# EAGLE design untitled (EAGLE 9.0.0)
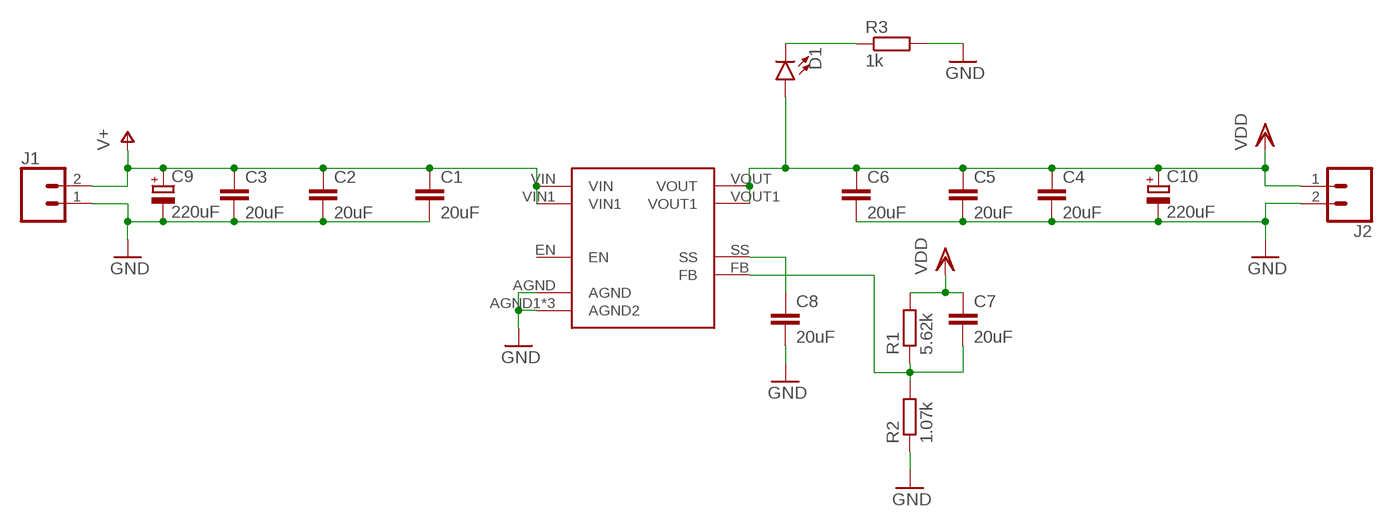
[diagram p0: schematic, sheet 1]

## Parts
C1  20uF  C-EUC0805K  [C0805K]
C2  20uF  C-EUC0805K  [C0805K]
C3  20uF  C-EUC0805K  [C0805K]
C4  20uF  C-EUC0805K  [C0805K]
C5  20uF  C-EUC0805K  [C0805K]
C6  20uF  C-EUC0805K  [C0805K]
C7  20uF  C-EUC0805K  [C0805K]
C8  20uF  C-EUC0805K  [C0805K]
C9  220uF  CPOL-EU153CLV-0810  [153CLV-0810]
C10  220uF  CPOL-EU153CLV-0810  [153CLV-0810]
D1  LED5MM  [LED_5MM]
J1  CONN_025MM  [SCREWTERMINAL-5MM-2]
J2  CONN_025MM  [SCREWTERMINAL-5MM-2]
R1  5.62k  R-EU_R0805  [R0805]
R2  1.07k  R-EU_R0805  [R0805]
R3  1k  R-EU_R0805  [R0805]
U$1  LMZ13610  [LMZ13610]

## Nets
GND: C1.2 C2.2 C3.2 C4.2 C5.2 C6.2 C8.2 C9.- C10.- J1.1 J2.2 R2.1 R3.2 U$1.AGND U$1.AGND1(AGND2) U$1.AGND2 U$1.AGND3(AGND2)
N$1: C8.1 U$1.SS
N$2: C7.2 R1.1 R2.2 U$1.FB
N$3: D1.K(C) R3.1
V+: C1.1 C2.1 C3.1 C9.+ J1.2 U$1.VIN U$1.VIN1
VDD: C4.1 C5.1 C6.1 C7.1 C10.+ D1.A J2.1 R1.2 U$1.VOUT U$1.VOUT1
Unconnected: U$1.EN

## Library data of the parts
C1-C8 = resistor:C-EU: CAPACITOR, European symbol
C9 C10 = resistor:CPOL-EU: POLARIZED CAPACITOR, European symbol
D1 = SparkFun-LED:LED: LED (Generic) Standard schematic elements and footprints for 5mm, 3mm, 1206, and 0603 sized LEDs. Generic LEDs with no color specified.
J1 J2 = SparkFun-Connectors:CONN_02: Multi connection point. Often used as Generic Header-pin footprint for 0.1 inch spaced/style header connections On any of the 0.1 inch spaced packages, you can populate with these: Break Away Headers - Straight <https://www.sparkfun.com/products/116> (PRT-00116) Break Away Male Headers - Right Angle <https://www.sparkfun.com/products/553> (PRT-00553) Female Headers <https://www.sparkfun.com/products/115> (PRT-00115) Break Away Headers - Machine Pin <https://www.sparkfun.com/products/117> (PRT-00117) Break Away Female Headers - Swiss Machine Pin <https://www.sparkfun.com/products/743> (PRT-00743) For SCREWTERMINALS and SPRING TERMINALS visit here: Screw Terimnals on SparkFun.com <https://www.sparkfun.com/search/results?term=Screw+Terminals> (5mm/3.5mm/2.54mm spacing) This device is also useful as a general connection point to wire up your design to another part of your project. Our various solder wires solder well into these plated through hole pads. Hook-Up Wire - Assortment (Stranded, 22 AWG) <https://www.sparkfun.com/products/11375> (PRT-11375) Hook-Up Wire - Assortment (Solid Core, 22 AWG) <https://www.sparkfun.com/products/11367> (PRT-11367) View the entire wire category on our website here <https://www.sparkfun.com/categories/141> Special notes: Molex polarized connector foot print use with: PRT-08233 with associated crimp pins and housings. 2.54_SCREWTERM for use with PRT-10571. 3.5mm Screw Terminal footprints for PRT-08084 5mm Screw Terminal footprints for use with PRT-08432; SF_SKU: PRT-08432
R1-R3 = resistor:R-EU_: RESISTOR, European symbol
U$1 = My lib:LMZ13610

## Board
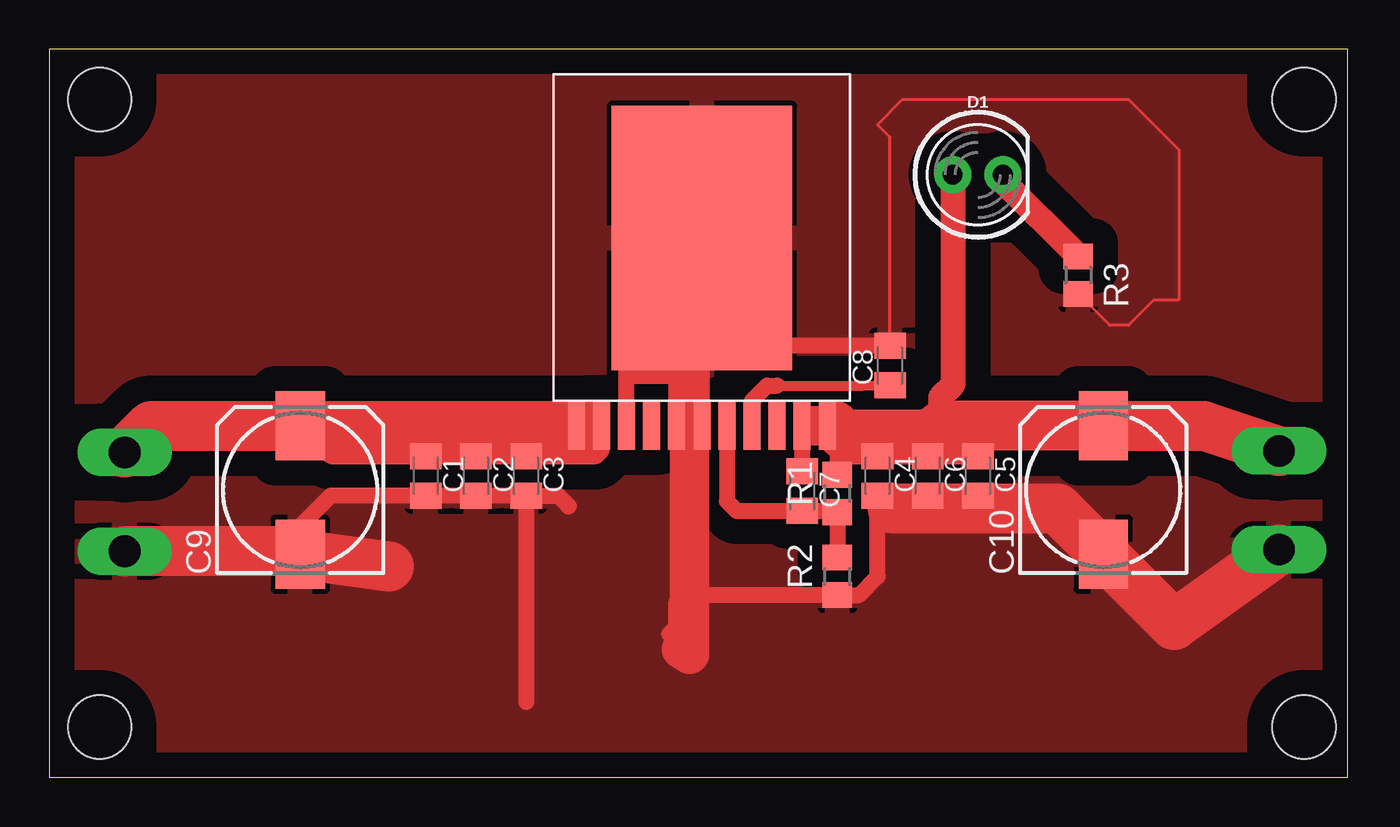
[diagram p1: board, top side]
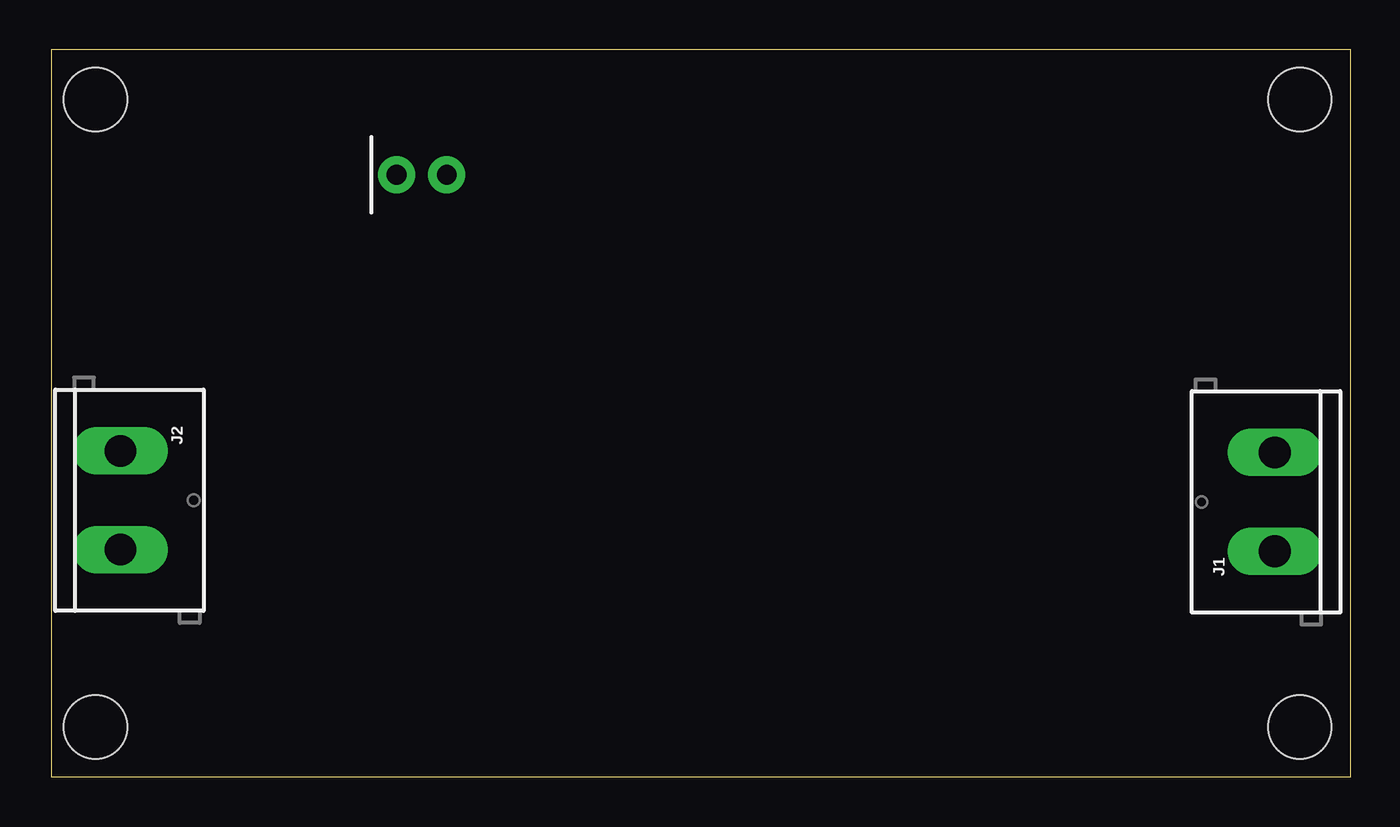
[diagram p2: board, bottom side, seen from below]

Size 65.71 x 36.82 mm. Coordinates in mm from the lower left corner, seen from the top.
Outline: 0,0 65.71,0 65.71,36.82 0,36.82 0,0
Copper layers (1*16): Top 0.035mm / dielectric 1.5mm / Bottom 0.035mm
Design rules "default": minimum track width 6mil, minimum drill 0.35mm, track to track 6mil, track to pad 6mil, pad to pad 6mil, via to via 6mil, smd to smd 6mil, copper to edge 40mil, drill to drill 6mil, minimum pad ring 10mil, minimum via ring 8mil, stop-mask expansion 4mil, vias tented up to drill 0mil, thermal gap 10mil
Holes 3.2 mm at 2.54,34.29 2.54,2.54 63.5,2.54 63.5,34.29

### Footprints (pad centres in the part's own frame; a part is rotated, then mirrored left to right if it is on the bottom)
C0805K = smd 1.3 x 1.6: 1 -1,0; 2 1,0
153CLV-0810 = smd 3.5 x 2.5: + 3.25,0; - -3.25,0
LED_5MM = drill 1 pad 1.88: A -1.27,0; K 1.27,0
SCREWTERMINAL-5MM-2 = drill 1.6 pad 2.032 long: 1 0,0; 2 5,0
R0805 = smd 1.3 x 1.5: 1 -0.95,0; 2 0.95,0
LMZ13610 = smd 0.86 x 2.41: AGND -3.81,0; AGND1 -1.27,0; AGND2 0,0; EN -2.54,0; FB 1.27,0; NC 3.81,0; SS 2.54,0; VIN -6.35,0; VIN1 -5.08,0; VOUT 5.08,0; VOUT1 6.35,0 | smd 9.126 x 13.37: AGND3 0,9.5

### Placement (x,y rotation side)
C1  19.05,15.24 270 top
C2  21.59,15.24 270 top
C3  24.13,15.24 270 top
C4  41.91,15.24 270 top
C5  46.99,15.24 270 top
C6  44.45,15.24 270 top
C7  38.1,14.48 270 top
C8  42.55,20.83 90 top
C9  12.7,14.53 90 top
C10  53.34,14.53 90 top
D1  46.99,30.48 0 top
J1  3.81,11.43 90 bottom
J2  62.23,16.51 270 bottom
R1  39.88,14.35 90 top
R2  39.88,10.16 90 top
R3  52.07,25.4 270 top
U$1  33.02,17.78 0 top

### Tracks (layer width: path | path; a pad name or v marks a point on that pad's centre or on a via)
GND
  Top 0.152: C8.2 42.55,32.38 41.91,33.02 43.18,34.29 54.61,34.29 57.15,31.75 57.15,24.13 55.88,24.13 54.61,22.86 53.66,22.86 R3.2
  Top 0.8: C8.2 32.62,21.83 32.38,21.59
  Top 0.813: C3.2 C2.2 C1.2 14.24,14.24 11.43,11.43 11.58,11.28 C9.- | U$1.AGND 29.21,20.32 | 29.21,20.32 29.21,21.59 | 29.21,21.59 29.21,22.86 | U$1.AGND1 31.75,20.32 | 31.75,20.32 31.75,21.59 | 31.75,21.59 29.21,21.59 | U$1.AGND2 33.02,20.32 | 33.02,20.32 33.02,21.59 32.38,21.59 31.75,21.59 | 29.21,20.32 31.75,20.32 | 31.75,20.32 33.02,20.32 | C3.2 25.77,14.24 26.29,13.72 26.27,13.69 | C3.2 24.13,3.81 | 32,6.48 31.75,7.62 | 31.75,7.62 31.75,8.89 32.07,9.21 R2.1 40.96,9.21 41.91,10.16 C4.2 44.18,14.24 44.45,13.97 C6.2 C5.2 | 31.75,7.62 31.37,7.24
  Top 2: 32,6.48 32.38,6.22 32.38,21.59 32.38,22.86 33.02,23.5 U$1.AGND3 33.02,21.59
  Top 2.54: J1.1 12.55,11.43 C9.- 17.17,10.67 | 42.67,13.59 51.03,13.59 C10.- 56.92,7.7 J2.2
  pour Top (isolate 1.27): -1.27,39.37 -1.27,-2.54 67.31,-2.54 67.31,39.37
N$1
  Top 0.508: C8.1 41.16,19.81 36.83,19.81
  Top 0.8: 35.56,19.05 36.32,19.81 36.83,19.81
  Top 0.813: U$1.SS 35.56,19.05
N$2
  Top 0.8: U$1.FB 34.29,13.97 34.78,13.48 C7.2
  Top 0.813: R2.2 R1.1 39.8,13.48 C7.2
N$3
  Top 1.27: R3.1 48.26,30.16 D1.K
V+
  Top 0.8: U$1.VIN1 27.3,18.41 27.3,18.67 | U$1.VIN 27.69,16.76 27.94,16.76
  Top 0.813: C9.+ 14.24,16.24 C1.1 C2.1 C3.1 | C3.1 24.13,17.78 U$1.VIN U$1.VIN1 27.94,16.76 27.94,16.51 27.67,16.24 C3.1
  Top 2.54: U$1.VIN C9.+ 5.16,17.78 J1.2
VDD
  Top 0.813: 38.68,17.78 U$1.VOUT C7.1 | U$1.VOUT1 39.88,17.27 39.88,16.51 | 39.88,16.51 R1.2 | 39.88,16.51 40.15,16.24 C4.1 C6.1 C5.1
  Top 1.27: 44.66,17.34 44.45,17.54 | 45.72,17.78 45.1,17.78 45.1,19.22 45.72,19.84 D1.A | 39.73,17.78 38.68,17.78
  Top 2: U$1.VOUT1 38.68,17.78
  Top 2.54: 45.72,17.78 C10.+ 58.42,17.78 J2.1 | 45.1,17.78 44.66,17.34 40.18,17.34 39.73,17.78